# EAGLE design robotic_arm_arduino_uno_shield_new (EAGLE 8.3.1)
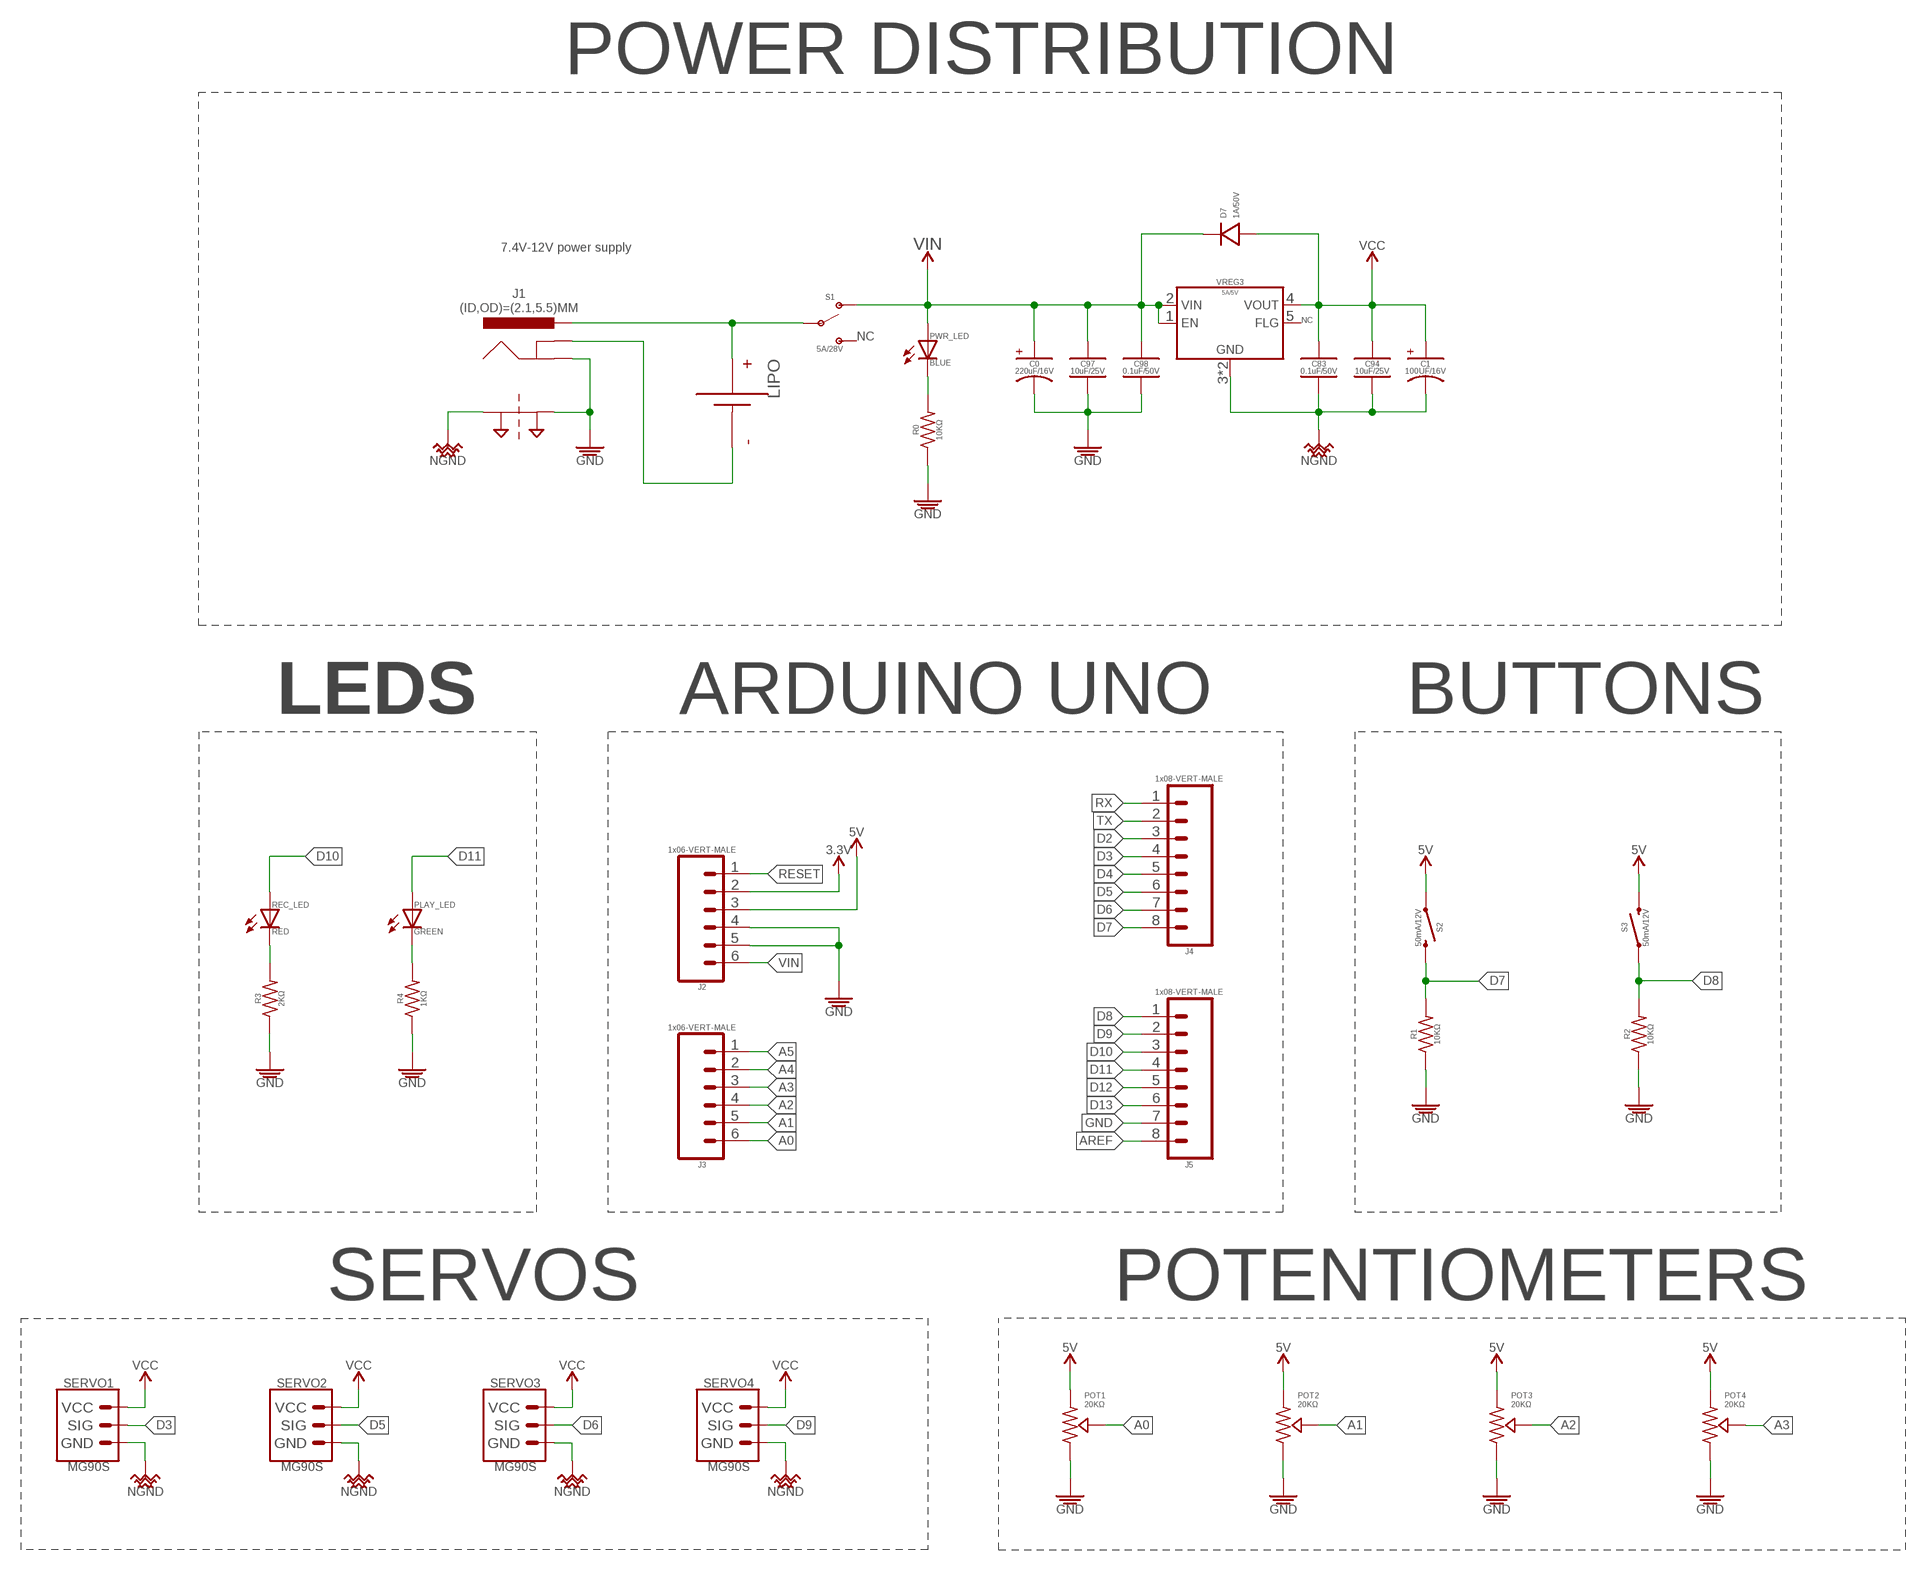
[diagram p0: schematic, sheet 1]

## Parts
C0  220uF/16V  CAP_POLARIZED_ALUM-ELECTROLYTIC_SMD_220UF-16V-20%  [CAP_POL_SMD_L6.6-W6.6]
C1  100UF/16V  CAP_POLARIZED_ALUM-ELECTROLYTIC_SMD_100UF-16V-20%  [CAP_POL_SMD_L6.6-W6.6]
C83  0.1uF/50V  CAP_CERAMIC_SMD-805_0.1UF-50V-10%  [CAP_CER_SMD-805]
C94  10uF/25V  CAP_CERAMIC_SMD-805_10UF-25V-10%  [CAP_CER_SMD-805]
C97  10uF/25V  CAP_CERAMIC_SMD-805_10UF-25V-10%  [CAP_CER_SMD-805]
C98  0.1uF/50V  CAP_CERAMIC_SMD-805_0.1UF-50V-10%  [CAP_CER_SMD-805]
D7  1A/50V  DIODE_GEN-PURPSMD_GP_1A-50V-SOD123F  [DIODE_SMD_1A-50V-SOD123F]
J1  (ID,OD)=(2.1,5.5)MM  POWER_JACK-BARREL_ID2.1MM-OD5.5MM  [POWER_JACK_SLOT_ID2.1MM-OD5.5MM]
J2  1x06-VERT-MALE  1X06VERT-MALE  [1X06-VERT-MALE]
J3  1x06-VERT-MALE  1X06VERT-MALE  [1X06-VERT-MALE]
J4  1x08-VERT-MALE  1X08VERT-MALE  [1X08-VERT-MALE]
J5  1x08-VERT-MALE  1X08VERT-MALE  [1X08-VERT-MALE]
LIPO  BATTERYPTH_HOLES  [DUAL_PTH_PADS]
PLAY_LED  GREEN  LED_SMD-805_DISCRETE_GREEN  [LED_SMD-805_]
POT1  20KΩ  POTENTIOMETERNO-MARKINGS_VERT-FEMALE  [CONNECTOR_POTENTIOMETER_NO-MARKINGS_FEMALE-HEADER]
POT2  20KΩ  POTENTIOMETERNO-MARKINGS_VERT-FEMALE  [CONNECTOR_POTENTIOMETER_NO-MARKINGS_FEMALE-HEADER]
POT3  20KΩ  POTENTIOMETERNO-MARKINGS_VERT-FEMALE  [CONNECTOR_POTENTIOMETER_NO-MARKINGS_FEMALE-HEADER]
POT4  20KΩ  POTENTIOMETERNO-MARKINGS_VERT-FEMALE  [CONNECTOR_POTENTIOMETER_NO-MARKINGS_FEMALE-HEADER]
PWR_LED  BLUE  LED_SMD-805_DISCRETE_BLUE  [LED_SMD-805_]
R0  10KΩ  RESISTORSMD-0805_1/8W_10K_5%  [RESISTOR_SMD-805]
R1  10KΩ  RESISTORSMD-0805_1/8W_10K_5%  [RESISTOR_SMD-805]
R2  10KΩ  RESISTORSMD-0805_1/8W_10K_5%  [RESISTOR_SMD-805]
R3  2KΩ  RESISTORSMD-0805_1/8W_2K_5%  [RESISTOR_SMD-805]
R4  1KΩ  RESISTORSMD-0805_1/8W_1K_5%  [RESISTOR_SMD-805]
REC_LED  RED  LED_SMD-805_DISCRETE_RED  [LED_SMD-805_]
S1  5A/28V  SWITCH_SPDT5A-28V_13L-7W  [SW-SLIDE_SPDT_5A-28V_13L-7W]
S2  50mA/12V  SWITCH_MOMENTARY_SPSTSPST-PTH-L12-W12-H7.2  [SPST-PTH-12MM]
S3  50mA/12V  SWITCH_MOMENTARY_SPSTSPST-PTH-L12-W12-H7.2  [SPST-PTH-12MM]
SERVO1  MG90S  SERVOMG90S_NO-MARKINGS  [CONNECTOR_SERVO_NO-MARKINGS]
SERVO2  MG90S  SERVOMG90S_NO-MARKINGS  [CONNECTOR_SERVO_NO-MARKINGS]
SERVO3  MG90S  SERVOMG90S_NO-MARKINGS  [CONNECTOR_SERVO_NO-MARKINGS]
SERVO4  MG90S  SERVOMG90S_NO-MARKINGS  [CONNECTOR_SERVO_NO-MARKINGS]
SUPPLY14  2PT_GND_TIE  [2PT_GND_TIE]
VREG3  5A/5V  VREG_MIC29501-5.0_LINEAR_ULDO_5A-5VMIC29501-5.0_5A-5V  [TO-263-5]

## Nets
3.3V: J2.2
5V: J2.3 POT1.CCW POT2.CCW POT3.CCW POT4.CCW S2.1 S3.3
+: J1.PWR LIPO.+(P) S1.P$2(P)
-: J1.GND@2(GND) LIPO.-(N)
A0: J3.6 POT1.S
A1: J3.5 POT2.S
A2: J3.4 POT3.S
A3: J3.3 POT4.S
A4: J3.2
A5: J3.1
AREF: J5.8
D2: J4.3
D3: J4.4 SERVO1.1(SIG)
D4: J4.5
D5: J4.6 SERVO2.1(SIG)
D6: J4.7 SERVO3.1(SIG)
D7: J4.8 R1.2 S2.3
D8: J5.1 R2.2 S3.1
D9: J5.2 SERVO4.1(SIG)
D10: J5.3 REC_LED.A
D11: J5.4 PLAY_LED.A
D12: J5.5
D13: J5.6
GND: C0.K C97.2 C98.2 J1.GND@1(GND) J2.4 J2.5 J5.7 POT1.CW POT2.CW POT3.CW POT4.CW R0.1 R1.1 R2.1 R3.1 R4.1 SUPPLY14.P$2
N$1: PLAY_LED.K R4.2
N$2: R3.2 REC_LED.K
N$4: PWR_LED.K R0.2
NGND: C1.K C83.2 C94.2 SERVO1.3(GND) SERVO2.3(GND) SERVO3.3(GND) SERVO4.3(GND) SUPPLY14.P$1 VREG3.3(GND) VREG3.TAB(GND)
RESET: J2.1
RX: J4.1
TX: J4.2
VCC: C1.A C83.1 C94.1 D7.A SERVO1.2(VCC) SERVO2.2(VCC) SERVO3.2(VCC) SERVO4.2(VCC) VREG3.4(VOUT)
VIN: C0.A C97.1 C98.1 D7.K J2.6 PWR_LED.A S1.P$1(S1) VREG3.1(EN) VREG3.2(VIN)
Unconnected: S1.P$3(S2) VREG3.5(FLG)

## Notes on the sheet
- POWER DISTRIBUTION
- 7.4V-12V power supply
- NC
- NC
- LEDS | ARDUINO UNO | BUTTONS
- SERVOS | POTENTIOMETERS

## Library data of the parts
C0 = MrSwirlyEyes:CAP_POLARIZED: Polarized Capacitors Variants sorted as [TYPE_PACKAGE_VALUE_V-RATING_TOLERANCE]; CREATOR: MrSwirlyEyes; DATASHEET: https://industrial.panasonic.com/cdbs/www-data/pdf/RDE0000/ABA0000C1240.pdf; DIST: Digikey; DISTLINK: https://www.digikey.com/products/en?keywords=P15089CT-ND; DISTPN: P15089CT-ND; MFR: Panasonic Electronic Components; MPN: EEE-FT1C221AP; TESTED: NO
C1 = MrSwirlyEyes:CAP_POLARIZED: Polarized Capacitors Variants sorted as [TYPE_PACKAGE_VALUE_V-RATING_TOLERANCE]; CREATOR: MrSwirlyEyes; DATASHEET: http://industrial.panasonic.com/www-cgi/jvcr13pz.cgi?E+PZ+3+ABA0120+EEEFK1C101P+7+WW; DIST: Digikey; DISTLINK: https://www.digikey.com/products/en?keywords=PCE3783CT-ND; DISTPN: PCE3783CT-ND; MFR: Panasonic Electronic Components; MPN: EEE-FK1C101P; TESTED: NO
C83 C98 = MrSwirlyEyes:CAP_CERAMIC: Ceramic Capacitors Sorted as [PACKAGE_VALUE_V-RATING_TOLERANCE]; CREATOR: MrSwirlyEyes; DATASHEET: http://psearch.en.murata.com/capacitor/product/GRM21BR71H104KA01%23.pdf; DIST: Digikey; DISTLINK: https://www.digikey.com/products/en?keywords=490-1666-1-ND; DISTPN: 490-1666-1-ND; MFR: Murata Electronics North America; MPN: GRM21BR71H104KA01L; TESTED: NO
C94 C97 = MrSwirlyEyes:CAP_CERAMIC: Ceramic Capacitors Sorted as [PACKAGE_VALUE_V-RATING_TOLERANCE]; CREATOR: MrSwirlyEyes; DATASHEET: http://search.murata.co.jp/Ceramy/image/img/A01X/G101/ENG/GRM21BR61E106KA73-01.pdf; DIST: Digikey; DISTLINK: https://www.digikey.com/products/en?keywords=490-5523-1-ND; DISTPN: 490-5523-1-ND; MFR: Murata Electronics North America; MPN: GRM21BR61E106KA73L; TESTED: NO
D7 = MrSwirlyEyes:DIODE_GEN-PURP; CREATOR: MrSwirlyEyes; DATASHEET: http://www.comchiptech.com/cms/UserFiles/CGRKM4001-HF%20Thru.%20CGRKM4007-HF%20RevG.pdf; DIST: Digikey; DISTLINK: https://www.digikey.com/products/en?keywords=641-1511-1-ND; DISTPN: 641-1511-1-ND; MFR: Comchip Technology; MPN: CGRKM4001-HF; TESTED: NO
J1 = MrSwirlyEyes:POWER_JACK-BARREL_ID2.1MM-OD5.5MM; CREATOR: MrSwirlyEyes; DATASHEET: http://www.memoryprotectiondevices.com/datasheets/EJ508A-datasheet.pdf; DIST: Digikey; DISTLINK: https://www.digikey.com/products/en?keywords=EJ508A-ND; DISTPN: EJ508A-ND; MFR: MPD (Memory Protection Devices); MPN: EJ508A; TESTED: NO
J2 J3 = connectors:1X06; CREATOR: MrSwirlyEyes; DATASHEET: http://www.sullinscorp.com/catalogs/77_PAGE108-109_.100_MALE_HDR.pdf; DIST: Digikey; DISTLINK: https://www.digikey.com/products/en?keywords=S1012E-06-ND; DISTPN: S1012E-06-ND; MFR: Sullins Connector Solutions; MPN: PEC06SAAN; TESTED: NO
J4 J5 = connectors:1X08; CREATOR: MrSwirlyEyes; DATASHEET: http://www.sullinscorp.com/catalogs/77_PAGE108-109_.100_MALE_HDR.pdf; DIST: Digikey; DISTLINK: https://www.digikey.com/products/en?keywords=PEC08SAAN; DISTPN: S1012E-08-ND; MFR: Sullins Connector Solutions; MPN: PEC08SAAN; TESTED: NO
LIPO = MrSwirlyEyes:BATTERY: Generic Dual SMD Pad for Bettery Soldering
PLAY_LED = MrSwirlyEyes:LED; CREATOR: MrSwirlyEyes; DATASHEET: http://optoelectronics.liteon.com/upload/download/DS22-2000-073/LTST-C170KGKT.pdf; DIST: Digikey; DISTLINK: https://www.digikey.com/products/en?keywords=160-1414-1-ND; DISTPN: 160-1414-1-ND; MFR: Lite-On Inc.; MPN: LTST-C170KGKT; TESTED: NO
POT1-POT4 = MrSwirlyEyes:POTENTIOMETER; CREATOR: MrSwirlyEyes; DATASHEET: http://www.bourns.com/docs/Product-Datasheets/PDB18.pdf; DATASHEET_CONNECTOR: http://sullinscorp.com/catalogs/101_PAGE114-115_.100_FEMALE_HDR.pdf; DIST: Digikey; DISTLINK: https://www.digikey.com/scripts/DkSearch/dksus.dll?Detail&itemSeq=237407307&uq=636398593910533334; DISTLINK_CONNECTOR: https://www.digikey.com/products/en?keywords=PPTC031LFBN-RC; DISTPN: PDB181-K420K-203B-ND; DISTPN_CONNECTOR: S7001-ND; DIST_CONNECTOR: Digikey; MFR: Bourns Inc.; MFR_CONNECTOR: Sullins Connector Solutions; MPN: PDB181-K420K-203B; MPN_CONNECTOR: PPTC031LFBN-RC
PWR_LED = MrSwirlyEyes:LED; CREATOR: MrSwirlyEyes; DATASHEET: http://optoelectronics.liteon.com/upload/download/DS-22-99-0226/LTST-C170TBKT.pdf; DIST: Digikey; DISTLINK: https://www.digikey.com/products/en?keywords=160-1579-1-ND; DISTPN: 160-1579-1-ND; MFR: Lite-On Inc.; MPN: LTST-C170TBKT; TESTED: NO
R0 R1 R2 = MrSwirlyEyes:RESISTOR; CREATOR: Kenmei; DATASHEET: http://www.yageo.com/documents/recent/PYu-RC_Group_51_RoHS_L_7.pdf; DIST: Digikey; DISTLINK: https://www.digikey.com/products/en?keywords=311-10KARCT-ND; DISTPN: 311-10KARCT-ND; MFR: Yageo; MPN: RC0805JR-0710KL; TESTED: YES
R3 = MrSwirlyEyes:RESISTOR; CREATOR: MrSwirlyEyes; DATASHEET: http://www.yageo.com/documents/recent/PYu-RC_Group_51_RoHS_L_7.pdf; DIST: Digikey; DISTLINK: https://www.digikey.com/products/en?keywords=311-2.0KARCT-ND; DISTPN: 311-2.0KARCT-ND; MFR: Yageo; MPN: RC0805JR-072KL
R4 = MrSwirlyEyes:RESISTOR; CREATOR: Kenmei; DATASHEET: http://www.yageo.com/documents/recent/PYu-RC_Group_51_RoHS_L_7.pdf; DIST: Digikey; DISTLINK: https://www.digikey.com/product-detail/en/yageo/RC0805JR-071KL/311-1.0KARCT-ND/731165; DISTPN: 311-1.0KARCT-ND; MFR: Yageo; MPN: RC0805JR-071KL; TESTED: NO
REC_LED = MrSwirlyEyes:LED; CREATOR: MrSwirlyEyes; DATASHEET: http://optoelectronics.liteon.com/upload/download/DS-22-99-0150/LTST-C170KRKT.pdf; DIST: Digikey; DISTLINK: https://www.digikey.com/products/en?keywords=160-1415-1-ND; DISTPN: 160-1415-1-ND; MFR: Lite-On Inc.; MPN: LTST-C170KRKT; TESTED: NO
S1 = MrSwirlyEyes:SWITCH_SPDT; CREATOR: MrSwirlyEyes; DATASHEET: https://www.e-switch.com/system/asset/product_line/data_sheet/129/100.pdf; DIST: Digikey; DISTLINK: https://www.digikey.com/products/en?keywords=%09EG2355-ND; DISTPN: EG2355-ND; MFR: E-Switch; MPN: 100SP1T1B4M2QE; TESTED: NO
S2 S3 = MrSwirlyEyes:SWITCH_MOMENTARY_SPST; CREATOR: MrSwirlyEyes; DATASHEET: https://www.sparkfun.com/datasheets/Components/Buttons/TSA12110%20TACT%20SWITCH.jpg; DIST: Sparkfun; DISTLINK: https://www.sparkfun.com/products/10302; DISTPN: COM-10302
SERVO1-SERVO4 = MrSwirlyEyes:SERVO; CREATOR: MrSwirlyEyes; DATASHEET: http://www.towerpro.com.tw/product/mg90s-3/; DATASHEET_CONNECTOR: http://sullinscorp.com/catalogs/101_PAGE114-115_.100_FEMALE_HDR.pdf; DIST: Amazon; DISTLINK: https://www.amazon.com/RioRand-MG90S-Metal-Geared-Helicopter/dp/B00M8SR0ZK/ref=sr_1_1?s=toys-and-games&ie=UTF8&qid=1472114876&sr=1-1&keywords=MG90s+Micro+Metal+Geared+Servo; DISTLINK_CONNECTOR: https://www.digikey.com/products/en?keywords=PPTC031LFBN-RC; DISTPN: N/A; DISTPN_CONNECTOR: S7001-ND; DIST_CONNECTOR: Digikey; MFR: TowerPro; MFR_CONNECTOR: Sullins Connector Solutions; MPN: MG90S; MPN_CONNECTOR: PPTC031LFBN-RC; TESTED: NO
SUPPLY14 = SparkFun-PowerSymbols:2PT_GND_TIE: Dual Ground Supply Power supply symbol for connecting two grounds. SparkFun Products: SparkFun AutoDriver - Stepper Motor Driver <https://www.sparkfun.com/products/11611>
VREG3 = MrSwirlyEyes:VREG_MIC29501-5.0_LINEAR_ULDO_5A-5V; CREATOR: MrSwirlyEyes; DATASHEET: http://ww1.microchip.com/downloads/en/DeviceDoc/20005685A.pdf; DIST: Digikey; DISTLINK: https://www.digikey.com/products/en?keywords=576-2240-ND; DISTPN: 576-2240-ND; MFR: Microchip Technology; MPN: MIC29501-5.0WU

## Net classes
1 power: width 0.254 mm

## Board
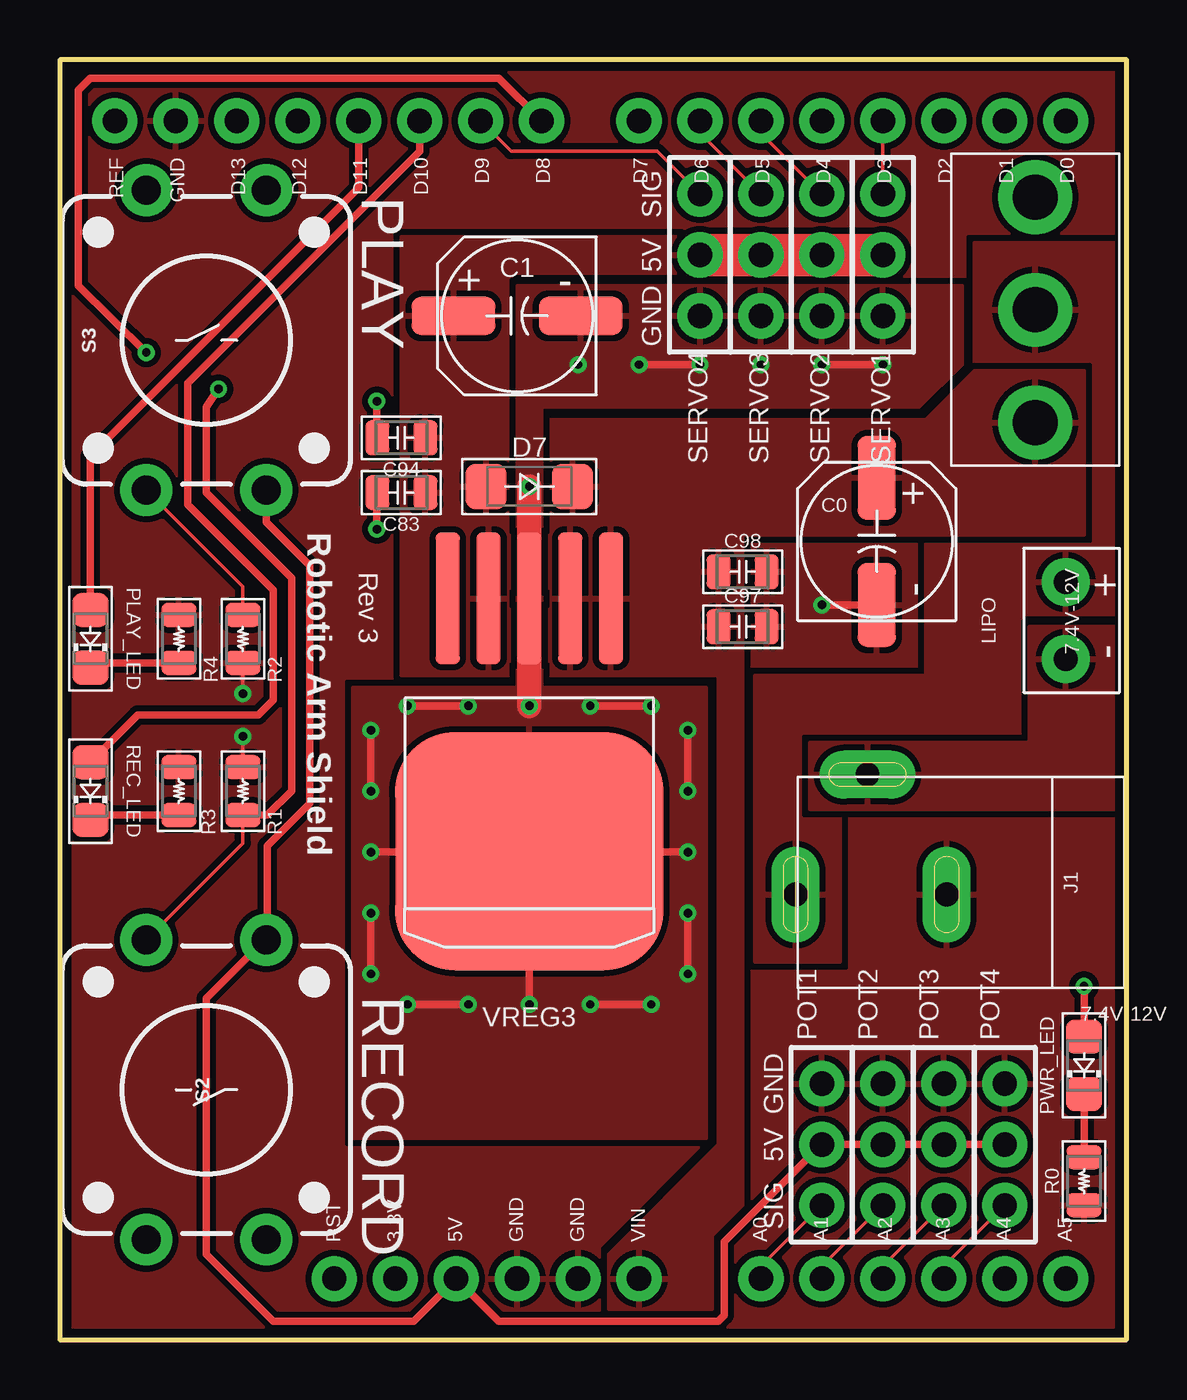
[diagram p1: board, top side]
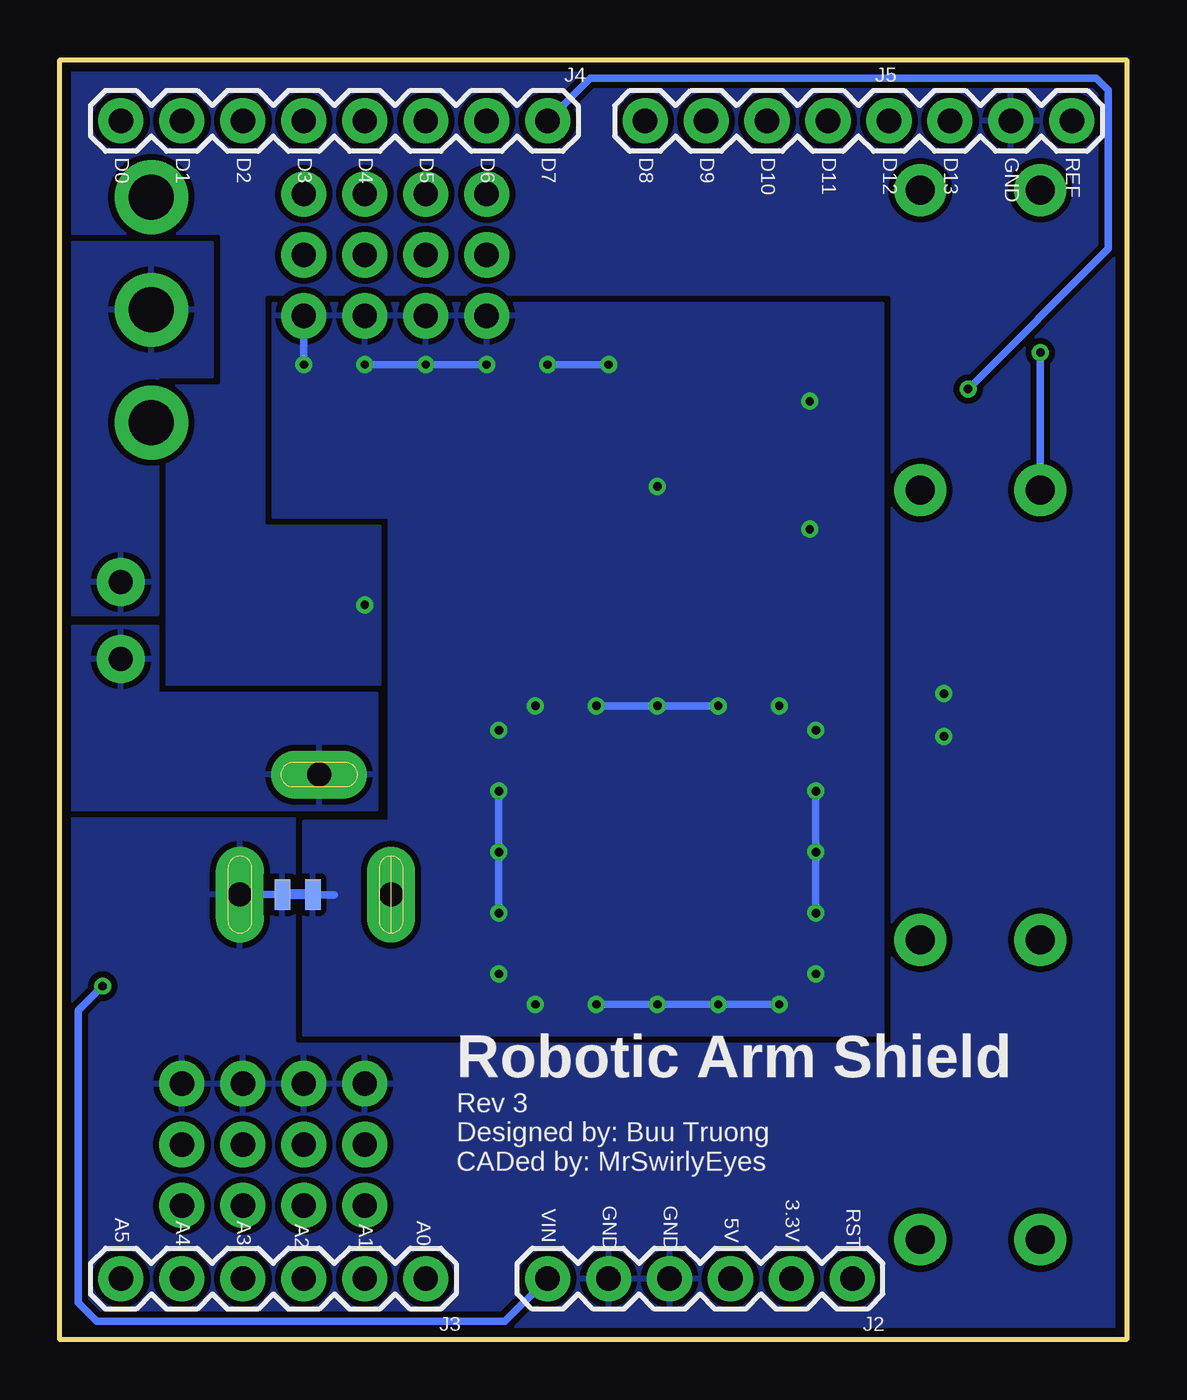
[diagram p2: board, bottom side, seen from below]

Size 44.45 x 53.34 mm. Coordinates in mm from the lower left corner, seen from the top.
Outline: 0,53.34 0,0 44.45,0 44.45,53.34 0,53.34
Copper layers (1*16): Top 0.0356mm / dielectric 1.5011mm / Bottom 0.0356mm
Design rules "oshpark-2layer": minimum track width 6mil, minimum drill 13mil, track to track 6mil, track to pad 6mil, pad to pad 6mil, via to via 6mil, smd to smd 6mil, copper to edge 15mil, drill to drill 6mil, minimum pad ring 7mil, minimum via ring 7mil, stop-mask expansion 2.5mil, vias tented up to drill 0mil, thermal gap 10mil

### Footprints (pad centres in the part's own frame; a part is rotated, then mirrored left to right if it is on the bottom)
CAP_POL_SMD_L6.6-W6.6 = smd 3.5 x 1.6: A -2.65,0; K 2.65,0
CAP_CER_SMD-805 = smd 1 x 1.45: 1 -1,0; 2 1,0
DIODE_SMD_1A-50V-SOD123F = smd 1.7 x 1.9: A -1.8,0; K 1.8,0
POWER_JACK_SLOT_ID2.1MM-OD5.5MM = drill 1 pad 2 long: GND@1 -0.5,-0.12; GND@2 4.5,3.18; PWR -0.5,6.18
1X06-VERT-MALE = drill 1.016 pad 1.88: 1 -6.35,0; 2 -3.81,0; 3 -1.27,0; 4 1.27,0; 5 3.81,0; 6 6.35,0
1X08-VERT-MALE = drill 1.016 pad 1.88: 1 -8.89,0; 2 -6.35,0; 3 -3.81,0; 4 -1.27,0; 5 1.27,0; 6 3.81,0; 7 6.35,0; 8 8.89,0
DUAL_PTH_PADS = drill 1 pad 2: + -1.6,0; - 1.6,0
LED_SMD-805_ = smd 1.4 x 1.5: A -1.2,0; K 1.2,0
CONNECTOR_POTENTIOMETER_NO-MARKINGS_FEMALE-HEADER = drill 1.016 pad 1.88: CCW 0,0; CW 2.54,0; S -2.54,0
RESISTOR_SMD-805 = smd 1 x 1.45: 1 -1,0; 2 1,0
SW-SLIDE_SPDT_5A-28V_13L-7W = drill 1.875 pad 3.075: P$1 -4.7,0; P$2 0,0; P$3 4.7,0
SPST-PTH-12MM = drill 1.2 pad 2.159: 1 6.25,-2.5; 2 -6.25,-2.5; 3 6.25,2.5; 4 -6.25,2.5
CONNECTOR_SERVO_NO-MARKINGS = drill 1.016 pad 1.88: 1 -2.54,0; 2 0,0; 3 2.54,0
2PT_GND_TIE = smd 1.27 x 0.635: P$1 0,0.635; P$2 0,-0.635
TO-263-5 = smd 1.02 x 5.5: 1 -3.4,-8.545; 2 -1.7,-8.545; 3 0,-8.545; 4 1.7,-8.545; 5 3.4,-8.545 | smd 11.18 x 9.91: TAB 0,2

### Placement (x,y rotation side)
C0  34.04,33.27 270 top
C1  19.05,42.67 0 top
C83  14.22,35.31 180 top
C94  14.22,37.59 180 top
C97  28.45,29.72 0 top
C98  28.45,32 0 top
D7  19.56,35.56 0 top
J1  36.83,19.05 90 top
J2  17.78,2.54 180 bottom
J3  35.56,2.54 0 bottom
J4  33.02,50.8 0 bottom
J5  11.18,50.8 0 bottom
LIPO  41.91,29.97 270 top
PLAY_LED  1.27,29.21 270 top
POT1  31.75,8.13 90 top
POT2  34.29,8.13 90 top
POT3  36.83,8.13 90 top
POT4  39.37,8.13 90 top
PWR_LED  42.67,11.43 270 top
R0  42.67,6.6 90 top
R1  7.62,22.86 270 top
R2  7.62,29.21 90 top
R3  4.95,22.86 270 top
R4  4.95,29.21 270 top
REC_LED  1.27,22.86 270 top
S1  40.64,42.93 90 top
S2  6.1,10.41 90 top
S3  6.1,41.66 270 top
SERVO1  34.29,45.21 270 top
SERVO2  31.75,45.21 270 top
SERVO3  29.21,45.21 270 top
SERVO4  26.67,45.21 270 top
SUPPLY14  34.54,18.55 270 bottom
VREG3  19.56,22.35 180 top

### Tracks (layer width: path | path; a pad name or v marks a point on that pad's centre or on a via)
5V
  Top 0.305: POT4.CCW POT3.CCW POT2.CCW POT1.CCW 27.69,4.06 27.69,1.02 27.43,0.76 18.29,0.76 J2.3 14.73,0.76 8.89,0.76 6.1,3.56 6.1,14.22 8.54,16.66 S2.1 8.64,16.7 8.64,20.57 10.41,22.35 10.41,32.26 8.6,34.08 S3.3
+
  pour Bottom (isolate 0.254, rank 5): 40.39,30.23 49.53,30.23 49.53,45.72 38.1,45.72 38.1,40.13 40.39,40.13
  pour Top (isolate 0.254, rank 5): 48.26,30.23 40.13,30.23 40.13,25.15 30.99,25.15 30.99,21.84 32.51,21.84 32.51,15.75 28.96,15.75 28.96,27.69 36.07,27.69 36.07,33.27 42.67,33.27 42.67,40.64 38.1,40.64 38.1,45.72 48.26,45.72
-
  pour Top (isolate 0.254, rank 4): 40.39,29.72 40.39,24.89 31.24,24.89 31.24,22.1 48.26,22.1 48.26,29.72
  pour Bottom (isolate 0.254, rank 4): 40.39,29.72 40.39,26.92 31.24,26.92 31.24,22.1 49.53,22.1 49.53,29.72
A0
  Top 0.152: POT1.S 29.21,3.05 J3.6
A1
  Top 0.152: POT2.S 31.75,3.05 J3.5
A2
  Top 0.152: POT3.S 34.29,3.05 J3.4
A3
  Top 0.152: POT4.S 36.83,3.05 J3.3
D3
  Top 0.152: SERVO1.1 J4.4
D5
  Top 0.152: SERVO2.1 29.21,50.29 J4.6
D6
  Top 0.152: SERVO3.1 26.67,50.29 J4.7
D7  (via drill 0.35)
  Top 0.152: S2.3 7.62,20.69 R1.2
  Top 0.305: R1.2 8.64,21.86 9.65,22.88 9.65,31.75 6.1,35.31 6.1,38.86 v6.6,39.62
  Bottom 0.305: J4.8 22.35,52.58 1.27,52.58 0.76,52.07 0.76,45.47 v6.6,39.62
D8  (via drill 0.35)
  Top 0.152: S3.1 7.62,31.38 R2.2
  Top 0.305: v3.6,41.15 0.76,43.94 0.76,52.07 1.27,52.58 18.29,52.58 J5.1
  Bottom 0.305: v3.6,41.15 S3.1
D9
  Top 0.152: SERVO4.1 24.89,49.53 18.8,49.53 J5.2
D10
  Top 0.305: REC_LED.A 3.25,26.04 8.26,26.04 8.89,26.67 8.89,31.24 5.33,34.8 5.33,39.88 14.99,49.53 J5.3
D11
  Top 0.305: J5.4 12.45,48.01 1.27,36.83 PLAY_LED.A
GND  (via drill 0.35)
  Top 0.152: R2.1 v7.62,26.92 | R1.1 v7.62,25.15
  Top 0.305: C0.K v31.75,30.62
  Bottom 0.305: SUPPLY14.P$2 J1.GND@1
  pour Bottom (isolate 0.254, rank 6): 46.99,55.88 46.99,-2.54 -2.54,-2.54 -2.54,55.88
  pour Top (isolate 0.254, rank 6): 45.72,54.61 45.72,-1.27 -1.27,-1.27 -1.27,54.61
N$1
  Top 0.305: PLAY_LED.K 1.47,28.21 R4.2
N$2
  Top 0.305: REC_LED.K 1.47,21.86 R3.2
N$4
  Top 0.305: R0.2 PWR_LED.K
NGND  (via drill 0.35)
  Top 0.305: C83.2 13.21,35.29 v13.21,33.78 | C94.2 13.21,37.61 v13.21,39.12 | v34.29,40.64 v31.75,40.64 | v26.67,40.64 v24.13,40.64 | v19.56,13.97 VREG3.TAB | v17.02,13.97 v14.48,13.97 | v22.1,13.97 v24.64,13.97 | VREG3.TAB 19.59,20.32 v26.16,20.32 | v26.16,17.78 v26.16,15.24 | VREG3.TAB 19.53,20.32 v12.95,20.32 | v12.95,17.78 v12.95,15.24 | v12.95,22.86 v12.95,25.4 | v26.16,22.86 v26.16,25.4 | v22.1,26.42 v24.64,26.42 | v17.02,26.42 v14.48,26.42
  Top 1.016: v19.56,26.42 VREG3.3 v19.56,35.56
  Bottom 0.305: SUPPLY14.P$1 33.02,18.54 | SERVO1.3 v34.29,40.64 | v31.75,40.64 v29.21,40.64 v26.67,40.64 | v24.13,40.64 v21.59,40.64 | v19.56,13.97 v17.02,13.97 | v14.48,13.97 v22.1,13.97 | v26.16,17.78 v26.16,20.32 v26.16,22.86 | v12.95,17.78 v12.95,20.32 v12.95,22.86 | v22.1,26.42 v19.56,26.42 v17.02,26.42
  pour Top (isolate 0.254): 37.59,43.94 19.05,43.94 19.05,27.18 12.19,27.18 12.19,8.38 26.92,8.38 26.92,27.18 20.07,27.18 20.07,38.86 35.81,38.86 37.59,40.64
  pour Bottom (isolate 0.254): 34.29,12.7 10.16,12.7 10.16,43.18 35.56,43.18 35.56,34.29 30.73,34.29 30.73,21.59 34.29,21.59
VCC
  Top 1.778: SERVO1.2 SERVO2.2 SERVO3.2 SERVO4.2
  pour Top (isolate 0.254, rank 2): 34.54,45.97 34.54,44.45 18.8,44.45 18.8,27.69 14.22,27.69 14.22,45.97
VIN  (via drill 0.35)
  Top 0.305: v42.67,14.73 PWR_LED.A
  Bottom 0.305: J2.6 25.91,0.76 42.93,0.76 43.69,1.52 43.69,13.72 v42.67,14.73
  pour Top (isolate 0.254, rank 4): 42.67,40.39 38.1,40.39 36.07,38.35 20.32,38.35 20.32,27.69 27.43,27.69 27.43,8.13 22.86,3.56 22.86,1.27 27.18,1.27 27.18,4.32 28.45,5.59 28.45,33.53 42.67,33.53

### Text on the board
tPlace: REF | GND | D13 | D12 | D11 | D10 | D9 | D8 | D7 | D6 | D5 | D4 | D3 | D2 | D1 | D0 | SIG | 5V | PLAY | GND | Robotic Arm Shield | Rev 3 | 7.4V-12V | 7.4V-12V | GND | RECORD | 5V | SIG | RST | 3.3V | 5V | GND | GND | VIN | A0 | A1 | A2 | A3 | A4 | A5
bPlace: REF | GND | D13 | D12 | D11 | D10 | D9 | D8 | D7 | D6 | D5 | D4 | D3 | D2 | D1 | D0 | Robotic Arm Shield | Rev 3 / Designed by: Buu Truong / CADed by: MrSwirlyEyes | 3.3V | GND | GND | RST | 5V | VIN | A0 | A1 | A2 | A3 | A4 | A5